# EAGLE design Practicum_update (EAGLE 9.5.1)
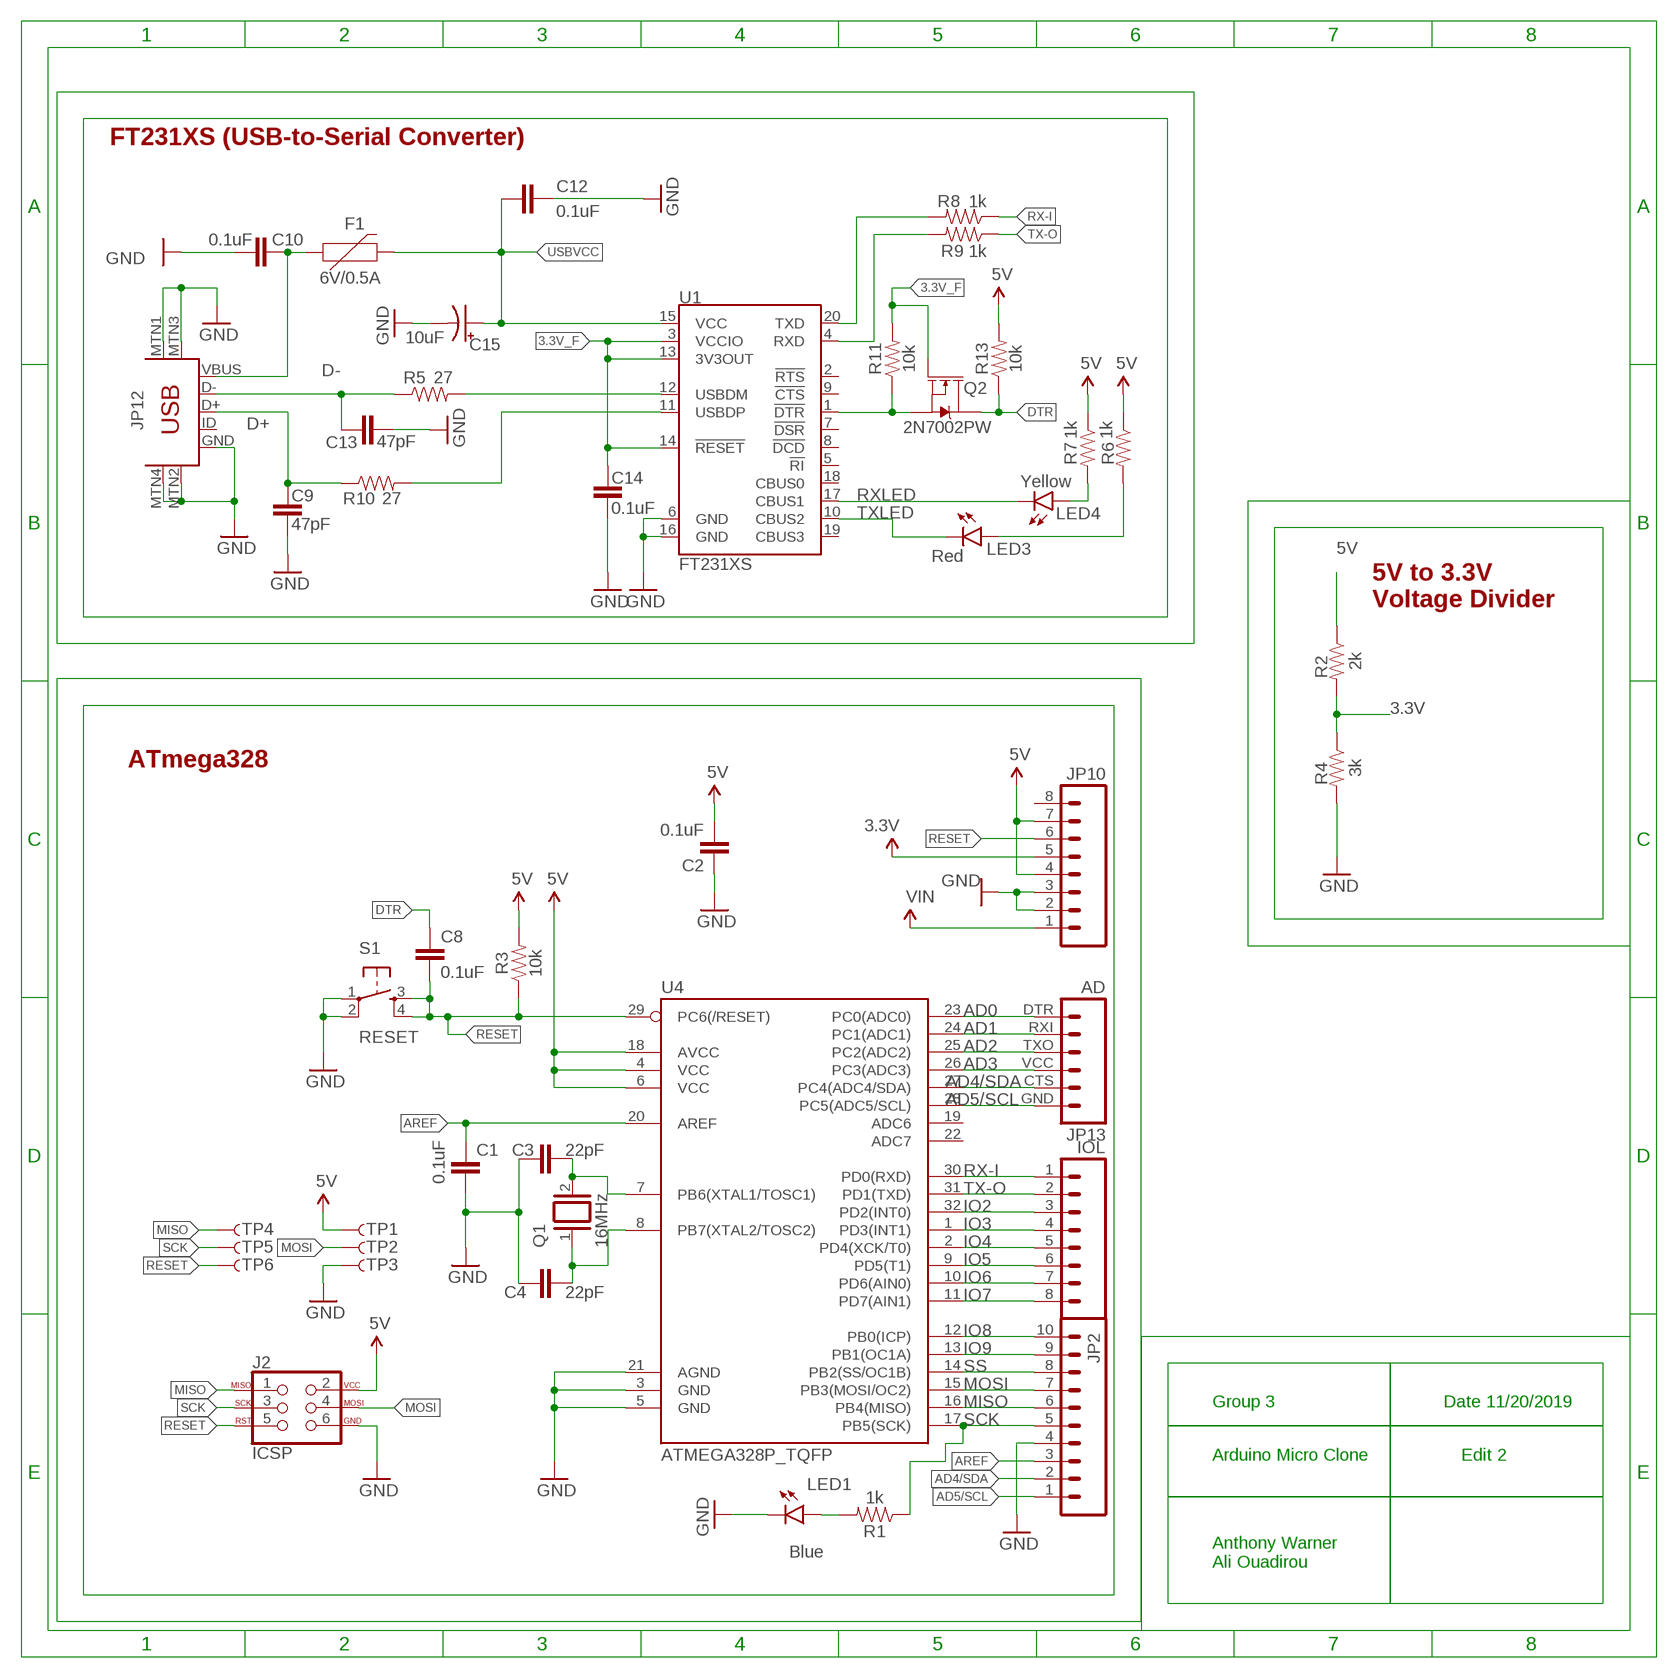
[diagram p0: schematic, sheet 1]

## Parts
C1  0.1uF  0.1UF-0603-25V-(+80/-20%)  [0603]
C2  0.1uF  0.1UF-0603-25V-(+80/-20%)  [0603]
C3  22pF  0.1UF-0603-25V-(+80/-20%)  [0603]
C4  22pF  0.1UF-0603-25V-(+80/-20%)  [0603]
C8  0.1uF  0.1UF-0603-25V-(+80/-20%)  [0603]
C9  47pF  47PF-0603-50V-5%  [0603]
C10  0.1uF  0.1UF-0603-25V-(+80/-20%)  [0603]
C12  0.1uF  0.1UF-0603-25V-(+80/-20%)  [0603]
C13  47pF  47PF-0603-50V-5%  [0603]
C14  0.1uF  0.1UF-0603-25V-(+80/-20%)  [0603]
C15  10uF  10UF-POLAR-EIA3216-16V-10%(TANT)  [EIA3216]
F1  6V/0.5A  PTC-HALF_AMP  [1206]
J2  ICSP  AVR_SPI_PROG_3X2NS  [2X3-NS]
JP2  M10"  [1X10]
JP10  M081X08  [1X08]
JP11  IOL  M081X08  [1X08]
JP12  USB-MINIB-5PIN  [USB-MINIB]
JP13  AD  M06SIP  [1X06]
LED1  Blue  LED1206  [LED-1206]
LED3  Red  LED1206  [LED-1206]
LED4  Yellow  LED1206  [LED-1206]
Q1  16MHz  XTAL/S  [QS]
Q2  2N7002PW  MOSFET-NCH-2N7002PW  [SOT323]
R1  1k  1KOHM-0603-1/10W-1%  [0603]
R2  2k  1KOHM-0603-1/10W-1%  [0603]
R3  10k  10KOHM-0603-1/10W-1%  [0603]
R4  3k  1KOHM-0603-1/10W-1%  [0603]
R5  27  27OHM-0603-1/10W-1%  [0603]
R6  1k  1KOHM-0603-1/10W-1%  [0603]
R7  1k  1KOHM-0603-1/10W-1%  [0603]
R8  1k  1KOHM-0603-1/10W-1%  [0603]
R9  1k  1KOHM-0603-1/10W-1%  [0603]
R10  27  27OHM-0603-1/10W-1%  [0603]
R11  10k  10KOHM-0603-1/10W-1%  [0603]
R13  10k  10KOHM-0603-1/10W-1%  [0603]
S1  RESET  SWITCH_SPST_4_PINSQUARE  [TACTILE-SWITCH-SMD]
TP1  TP-3x5  TEST-POINT3X5  [PAD.03X.05]
TP2  TP-3x5  TEST-POINT3X5  [PAD.03X.05]
TP3  TP-3x5  TEST-POINT3X5  [PAD.03X.05]
TP4  TP-3x5  TEST-POINT3X5  [PAD.03X.05]
TP5  TP-3x5  TEST-POINT3X5  [PAD.03X.05]
TP6  TP-3x5  TEST-POINT3X5  [PAD.03X.05]
U1  FT231XS  [SSOP20_L]
U4  ATMEGA328P_TQFP  [TQFP32-08]

## Nets
3.3V [3.3V]: JP10.5 R2.2 R4.1
3.3V_F [3.3V]: C14.1 Q2.1(G) R11.2 U1.3(VCCIO) U1.13(3V3OUT) U1.14(!RESET)
5V [5V]: C2.2 J2.2 JP10.4 JP10.7 R2.1 R3.2 R6.1 R7.1 R13.2 TP1.P$1 U4.4(VCC) U4.6(VCC) U4.18(AVCC)
AD0: JP13.DTR U4.23(PC0(ADC0))
AD1: JP13.RXI U4.24(PC1(ADC1))
AD2: JP13.TXO U4.25(PC2(ADC2))
AD3: JP13.VCC U4.26(PC3(ADC3))
AD4/SDA: JP2.2 JP13.CTS U4.27(PC4(ADC4/SDA))
AD5/SCL: JP2.1 JP13.GND U4.28(PC5(ADC5/SCL))
AREF: C1.1 JP2.3 U4.20(AREF)
D+: C9.1 JP12.D+ R10.1
D-: C13.1 JP12.D- R5.1
DTR: C8.1 Q2.3(D) R13.1
FTDI_DTR: Q2.2(S) R11.1 U1.1(!DTR)
GND [GND]: C1.2 C2.1 C3.1 C4.1 C9.2 C10.2 C12.2 C13.2 C14.2 C15.- J2.6 JP2.4 JP10.2 JP10.3 JP12.GND JP12.MTN1(MTN2) JP12.MTN2(MTN3) JP12.MTN3(MTN1) JP12.MTN4 LED1.C R4.2 S1.1 S1.2 TP3.P$1 U1.6(GND) U1.16(GND) U4.3(GND) U4.5(GND) U4.21(AGND)
IO2: JP11.3 U4.32(PD2(INT0))
IO3: JP11.4 U4.1(PD3(INT1))
IO4: JP11.5 U4.2(PD4(XCK/T0))
IO5: JP11.6 U4.9(PD5(T1))
IO6: JP11.7 U4.10(PD6(AIN0))
IO7: JP11.8 U4.11(PD7(AIN1))
IO8: JP2.10 U4.12(PB0(ICP))
IO9: JP2.9 U4.13(PB1(OC1A))
MISO: J2.1 JP2.6 TP4.P$1 U4.16(PB4(MISO))
MOSI: J2.4 JP2.7 TP2.P$1 U4.15(PB3(MOSI/OC2))
N$1: LED1.A R1.2
N$2: C4.2 Q1.1 U4.8(PB7(XTAL2/TOSC2))
N$3: C3.2 Q1.2 U4.7(PB6(XTAL1/TOSC1))
N$5: R10.2 U1.11(USBDP)
N$6: R5.2 U1.12(USBDM)
N$8: LED3.A R6.2
N$10: LED4.A R7.2
RESET: C8.2 J2.5 JP10.6 R3.1 S1.3 S1.4 TP6.P$1 U4.29(PC6(/RESET))
RX-I: JP11.1 R8.1 U4.30(PD0(RXD))
RXD: R9.2 U1.4(RXD)
RXLED: LED4.C U1.17(CBUS1)
SCK: J2.3 JP2.5 R1.1 TP5.P$1 U4.17(PB5(SCK))
SS: JP2.8 U4.14(PB2(SS/OC1B))
TX-O: JP11.2 R9.1 U4.31(PD1(TXD))
TXD: R8.2 U1.20(TXD)
TXLED: LED3.C U1.10(CBUS2)
USBVCC: C12.1 C15.+ F1.2 U1.15(VCC)
VIN: JP10.1
VUSB: C10.1 F1.1 JP12.VBUS
Unconnected: JP10.8 JP12.ID U1.2(!RTS) U1.5(!RI) U1.7(!DSR) U1.8(!DCD) U1.9(!CTS) U1.18(CBUS0) U1.19(CBUS3) U4.19(ADC6) U4.22(ADC7)

## Notes on the sheet
- FT231XS (USB-to-Serial Converter)
- 5V to 3.3V
  Voltage Divider
- ATmega328
- Group 3 | Date 11/20/2019
- Arduino Micro Clone | Edit 2
- Anthony Warner
  Ali Ouadirou

## Library data of the parts
C1 C2 C8 C10 C12 C14 = SparkFun-Capacitors:0.1UF: 0.1µF ceramic capacitors A capacitor is a passive two-terminal electrical component used to store electrical energy temporarily in an electric field.; PROD_ID: CAP-00810
C3 C4 = SparkFun-Capacitors:0.1UF: 0.1µF ceramic capacitors A capacitor is a passive two-terminal electrical component used to store electrical energy temporarily in an electric field.; PROD_ID: CAP-00810; VALUE: 0.1uF
C9 C13 = SparkFun-Capacitors:47PF: 47pF ceramic capacitors A capacitor is a passive two-terminal electrical component used to store electrical energy temporarily in an electric field.; PROD_ID: CAP-08913
C15 = SparkFun-Capacitors:10UF-POLAR: 10.0µF polarized capacitors A capacitor is a passive two-terminal electrical component used to store electrical energy temporarily in an electric field.; PROD_ID: CAP-00811
F1 = SparkFun-Fuses:PTC: Resettable Fuse PTC Resettable Fuse. Really a resistor with a postive temperature coefficient who's resistance increases dramatically with an increase in temperature. When heated by the power passing through the resistance rises causing the current to be limited, protecting the circuit. When a PTC cools back down it resumes conducting letting the circuit turn back on.; PROD_ID: RES-08585
J2 = SparkFun-Connectors:AVR_SPI_PROG_3X2: AVR ISP 6 Pin This is the reduced ISP connector for AVR programming. Common on Arduino. This footprint will take up less PCB space and can be used with a 10-pin to 6-pin adapter such as SKU: BOB-08508 **Special note about "TEST_POINT" package. The stop mask is on the top side, so if you want your programming test points to be on the bottom of your board, make sure to place this package on the bottom side of the board. This also ensure that the orientation to program from the bottom side will be correct.
JP2 = SparkFun-Connectors:M10: Header 10 Standard 10-pin 0.1" header. Use with straight break away headers (SKU : PRT-00116), right angle break away headers (PRT-00553), swiss pins (PRT-00743), machine pins (PRT-00117), and female headers (PRT-00115).; PROD_ID: CONN-11219
JP10 JP11 = SparkFun-Connectors:M08: Header 8 Standard 8-pin 0.1" header. Use with straight break away headers (SKU : PRT-00116), right angle break away headers (PRT-00553), swiss pins (PRT-00743), machine pins (PRT-00117), and female headers (PRT-00115).; PROD_ID: CONN-10204
JP12 = SparkFun-Connectors:USB-MINIB: Mini-USB "B" connector with 5th pin broken out. Created new symbol breaking out 5th "ID" pin in mini/micro USB connector spec. See: http://en.wikipedia.org/wiki/Mini_usb#Cables. Uses same footprint as 4-pin symbol. Also added pins to connect to mounting / shield pads if required (probably not generally needed as signals aren't shielded once they leave the connector).; PROD_ID: CONN-08193
JP13 = SparkFun-Connectors:M06: Header 6 Standard 6-pin 0.1" header. Use with straight break away headers (SKU : PRT-00116), right angle break away headers (PRT-00553), swiss pins (PRT-00743), machine pins (PRT-00117), and female headers (PRT-00115). Molex polarized connector foot print use with SKU : PRT-08094 with associated crimp pins and housings. NOTES ON THE VARIANTS LOCK and LOCK_LONGPADS... This footprint was designed to help hold the alignment of a through-hole component (i.e. 6-pin header) while soldering it into place. You may notice that each hole has been shifted either up or down by 0.005 of an inch from it's more standard position (which is a perfectly straight line). This slight alteration caused the pins (the squares in the middle) to touch the edges of the holes. Because they are alternating, it causes a "brace" to hold the component in place. 0.005 has proven to be the perfect amount of "off-center" position when using our standard breakaway headers. Although looks a little odd when you look at the bare footprint, once you have a header in there, the alteration is very hard to notice. Also,if you push a header all the way into place, it is covered up entirely on the bottom side. This idea of altering the position of holes to aid alignment will be further integrated into the Sparkfun Library for other footprints. It can help hold any component with 3 or more connection pins.; PROD_ID: CONN-10203
LED1 = SparkFun-LED:LED: LED (Generic) Standard schematic elements and footprints for 5mm, 3mm, 1206, and 0603 sized LEDs. Generic LEDs with no color specified.; PROD_ID: DIO-09911
LED3 = SparkFun-LED:LED: LED (Generic) Standard schematic elements and footprints for 5mm, 3mm, 1206, and 0603 sized LEDs. Generic LEDs with no color specified.; PROD_ID: DIO-09912
LED4 = SparkFun-LED:LED: LED (Generic) Standard schematic elements and footprints for 5mm, 3mm, 1206, and 0603 sized LEDs. Generic LEDs with no color specified.; PROD_ID: DIO-09909
Q1 = special:XTAL/S: CRYSTAL
Q2 = SparkFun-DiscreteSemi:MOSFET-NCH: N-channel MOSFETs Voltage controlled devices that allow control of high current outputs.; PROD_ID: TRANS-11151; VALUE: 310mA/60V/1.6Ω
R1 R6-R9 = SparkFun-Resistors:1KOHM: 1kΩ resistor A resistor is a passive two-terminal electrical component that implements electrical resistance as a circuit element. Resistors act to reduce current flow, and, at the same time, act to lower voltage levels within circuits.; PROD_ID: RES-07856
R2 R4 = SparkFun-Resistors:1KOHM: 1kΩ resistor A resistor is a passive two-terminal electrical component that implements electrical resistance as a circuit element. Resistors act to reduce current flow, and, at the same time, act to lower voltage levels within circuits.; PROD_ID: RES-07856; VALUE: 1k
R3 R11 R13 = SparkFun-Resistors:10KOHM: 10kΩ resistor A resistor is a passive two-terminal electrical component that implements electrical resistance as a circuit element. Resistors act to reduce current flow, and, at the same time, act to lower voltage levels within circuits.; PROD_ID: RES-00824
R5 R10 = SparkFun-Resistors:27OHM: 27Ω resistor A resistor is a passive two-terminal electrical component that implements electrical resistance as a circuit element. Resistors act to reduce current flow, and, at the same time, act to lower voltage levels within circuits.; PROD_ID: RES-09334
S1 = SparkFun-Electromechanical:SWITCH_SPST_4_PIN; PROD_ID: SWCH-08247
TP1-TP4 TP6 = SparkFun-Connectors:TEST-POINT: Bare copper test points for troubleshooting or ICT
TP5 = SparkFun-Passives:TEST-POINT: Bare copper test points for troubleshooting or ICT
U1 = SparkFun-IC-Comms:FT231X: FTDI FT231X Full Speed USB to Full-handshake UART This USB2.0 Full Speed IC offers a compact bridge to full handshake UART interfaces. The device is a UART, capable of operating up to 3MBaud, with low power consumption (8mA). The FT231X includes the complete FT-X series feature set and enables USB to be added into a system design quickly and easily over a UART interface.; PROD_ID: IC-11524
U4 = SparkFun-IC-Microcontroller:ATMEGA328P_TQFP; PROD_ID: IC-09069

## Net classes
0 default: width 0.356 mm, drill 0.305 mm, clearance 0.152 mm
1 5V: width 0.61 mm, drill 0.305 mm, clearance 0.152 mm to class 0, clearance 0.152 mm
2 3.3V: width 0.61 mm, drill 0.305 mm, clearance 0.152 mm to class 0, clearance 0.152 mm
3 GND: width 0.356 mm, drill 0.305 mm, clearance 0.152 mm to class 0, clearance 0.152 mm

## Board
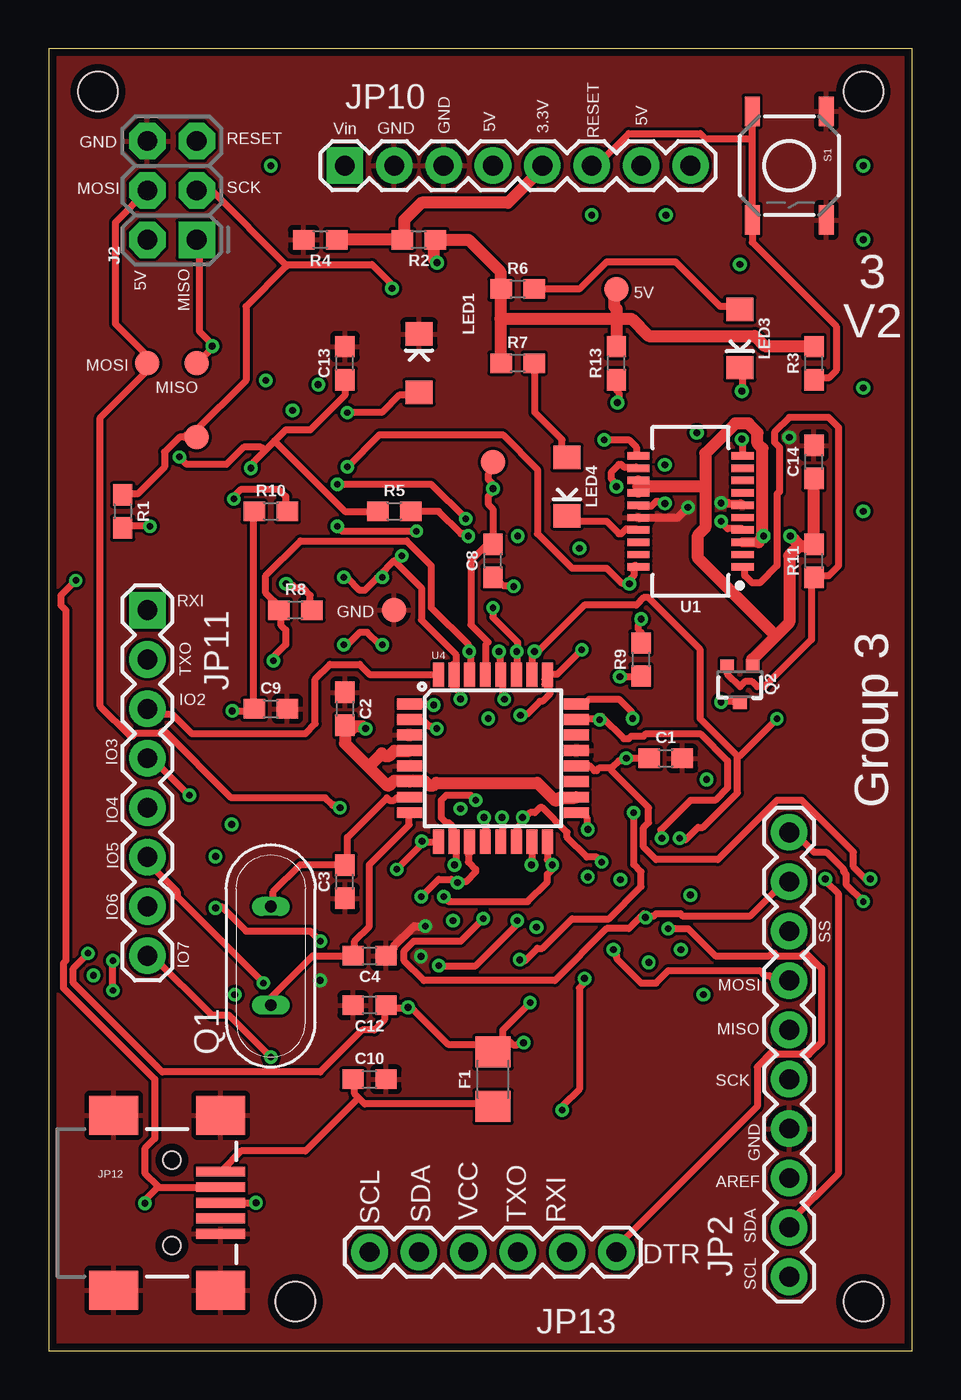
[diagram p1: board, top side]
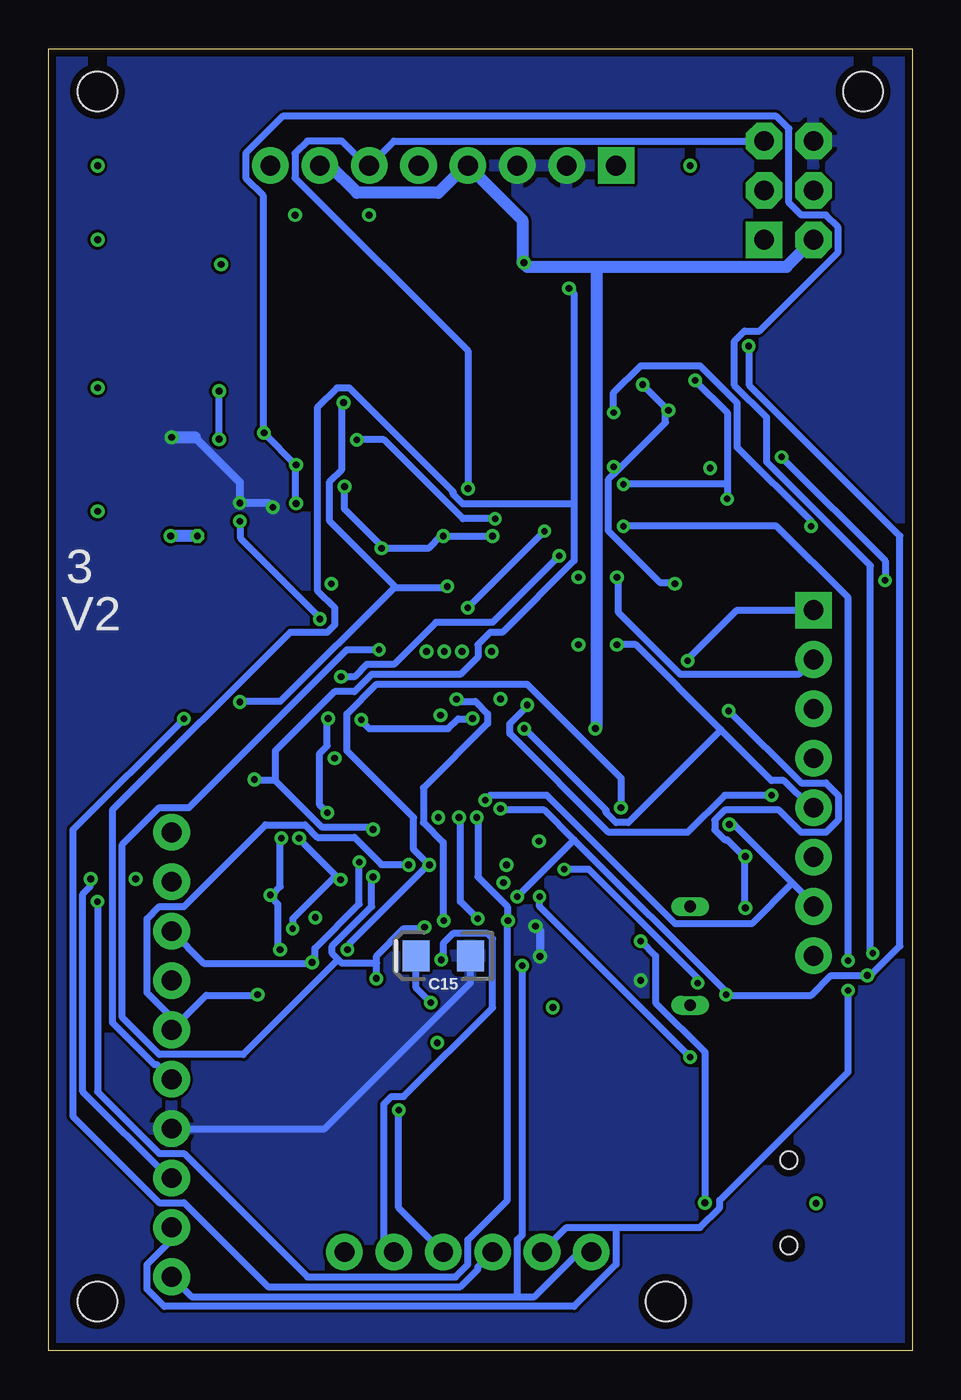
[diagram p2: board, bottom side, seen from below]

Size 44.43 x 66.98 mm. Coordinates in mm from the lower left corner, seen from the top.
Outline: 0,0 44.43,0 44.43,66.98 0,66.98 0,0
Copper layers (1*16): Top 0.0356mm / dielectric 1.5011mm / Bottom 0.0356mm
Design rules "LaenPCBOrder": minimum track width 6mil, minimum drill 13mil, track to track 6mil, track to pad 6mil, pad to pad 6mil, via to via 6mil, smd to smd 6mil, copper to edge 15mil, drill to drill 6mil, minimum pad ring 7mil, minimum via ring 7mil, stop-mask expansion 3mil, vias tented up to drill 0mil, thermal gap 10mil
Holes 2.03 mm at 2.54,64.77 41.91,64.77 12.7,2.54 41.91,2.54

### Footprints (pad centres in the part's own frame; a part is rotated, then mirrored left to right if it is on the bottom)
0603 = smd 1.1 x 1: 1 -0.85,0; 2 0.85,0
EIA3216 = smd 1.4 x 1.6: + 1.4,0; - -1.4,0
1206 = smd 1.6 x 1.8: 1 -1.4,0; 2 1.4,0
2X3-NS = drill 1.016 pad 1.88 square: 1 -2.54,-1.27 | drill 1.016 pad 1.88 octagon: 2 -2.54,1.27; 3 0,-1.27; 4 0,1.27; 5 2.54,-1.27; 6 2.54,1.27
1X10 = drill 1.016 pad 1.88: 1 0,0; 2 2.54,0; 3 5.08,0; 4 7.62,0; 5 10.16,0; 6 12.7,0; 7 15.24,0; 8 17.78,0; 9 20.32,0; 10 22.86,0
1X08 = drill 1.016 pad 1.88 square: 1 0,0 | drill 1.016 pad 1.88: 2 2.54,0; 3 5.08,0; 4 7.62,0; 5 10.16,0; 6 12.7,0; 7 15.24,0; 8 17.78,0
USB-MINIB = smd 2.5 x 0.5: D+ 2.5,0; D- 2.5,0.8; GND 2.5,-1.6; ID 2.5,-0.8; VBUS 2.5,1.6 | smd 2.5 x 2: MTN1 -3,4.5; MTN2 2.5,4.5; MTN3 -3,-4.5; MTN4 2.5,-4.5 | hole 0.9: 0,2.2; 0,-2.2
1X06 = drill 1.016 pad 1.88: CTS 10.16,0; DTR 0,0; GND 12.7,0; RXI 2.54,0; TXO 5.08,0; VCC 7.62,0
LED-1206 = smd 1.2 x 1.4: A -1.5,0; C 1.5,0
QS = drill 0.61 long: 1 -2.54,0; 2 2.54,0
SOT323 = smd 0.7 x 0.7: 1 -0.65,-0.925; 2 0.65,-0.925; 3 0,0.925
TACTILE-SWITCH-SMD = smd 1.524 x 0.762: 1 -2.794,1.905; 2 2.794,1.905; 3 -2.794,-1.905; 4 2.794,-1.905
PAD.03X.05 = smd 1.27 x 1.27: P$1 0,0
SSOP20_L = smd 0.381 x 1.143: 1 -2.857,-2.68; 2 -2.223,-2.68; 3 -1.587,-2.68; 4 -0.953,-2.68; 5 -0.318,-2.68; 6 0.318,-2.68; 7 0.953,-2.68; 8 1.587,-2.68; 9 2.223,-2.68; 10 2.857,-2.68; 11 2.857,2.68; 12 2.223,2.68; 13 1.587,2.68; 14 0.953,2.68; 15 0.318,2.68; 16 -0.318,2.68; 17 -0.953,2.68; 18 -1.587,2.68; 19 -2.223,2.68; 20 -2.857,2.68
TQFP32-08 = smd 1.27 x 0.559: 1 -4.293,2.8; 2 -4.293,2; 3 -4.293,1.2; 4 -4.293,0.4; 5 -4.293,-0.4; 6 -4.293,-1.2; 7 -4.293,-2; 8 -4.293,-2.8; 17 4.293,-2.8; 18 4.293,-2; 19 4.293,-1.2; 20 4.293,-0.4; 21 4.293,0.4; 22 4.293,1.2; 23 4.293,2; 24 4.293,2.8 | smd 0.559 x 1.27: 9 -2.8,-4.293; 10 -2,-4.293; 11 -1.2,-4.293; 12 -0.4,-4.293; 13 0.4,-4.293; 14 1.2,-4.293; 15 2,-4.293; 16 2.8,-4.293; 25 2.8,4.293; 26 2,4.293; 27 1.2,4.293; 28 0.4,4.293; 29 -0.4,4.293; 30 -1.2,4.293; 31 -2,4.293; 32 -2.8,4.293

### Placement (x,y rotation side)
C1  31.75,30.48 0 top
C2  15.24,33.02 270 top
C3  15.24,24.13 90 top
C4  16.51,20.32 180 top
C8  22.86,40.64 90 top
C9  11.43,33.02 0 top
C10  16.51,13.97 0 top
C12  16.51,17.78 180 top
C13  15.24,50.8 90 top
C14  39.37,45.72 90 top
C15  24.13,20.32 180 bottom
F1  22.86,13.97 90 top
J2  6.35,59.69 90 top
JP2  38.1,3.81 90 top
JP10  15.24,60.96 0 top
JP11  5.08,38.1 270 top
JP12  6.35,7.62 0 top
JP13  29.21,5.08 180 top
LED1  19.05,50.8 90 top
LED3  35.56,52.07 270 top
LED4  26.67,44.45 270 top
Q1  11.43,20.32 90 top
Q2  35.56,34.29 180 top
R1  3.81,43.18 270 top
R2  19.05,57.15 180 top
R3  39.37,50.8 90 top
R4  13.97,57.15 180 top
R5  17.78,43.18 0 top
R6  24.13,54.61 0 top
R7  24.13,50.8 0 top
R8  12.7,38.1 0 top
R9  30.48,35.56 90 top
R10  11.43,43.18 0 top
R11  39.37,40.64 90 top
R13  29.21,50.8 90 top
S1  38.1,60.96 270 top
TP1  29.21,54.61 0 top
TP2  5.08,50.8 0 top
TP3  17.78,38.1 0 top
TP4  7.62,50.8 0 top
TP5  7.62,46.99 0 top
TP6  22.86,45.72 0 top
U1  33.02,43.18 90 top
U4  22.86,30.48 0 top

### Tracks (layer width: path | path; a pad name or v marks a point on that pad's centre or on a via)
3.3V
  Top 0.61: R4.1 R2.2 18.29,57.4 18.29,58.17 19.18,59.05 23.62,59.05 25.4,60.83 JP10.5
3.3V_F  (via drill 0.35, 0.35 pad 0.55)
  Top 0.508: U1.3 36.51,41.59 | U1.13 30.34,44.48 U1.14
  Top 0.61: 37.4,36.77 38.1,37.47 38.1,40.89 38.61,41.4 38.66,41.4 | 37.4,36.77 36.2,35.56 36.2,35.31 Q2.1 | C14.1 R11.2 39.37,41.4 38.66,41.4 | 37.4,36.77 33.4,40.77 33.4,41.95 33.78,42.34 33.78,44.55 | 36.51,41.59 v36.78,41.91 36.73,41.96 36.73,46.42 36.47,46.67 36.47,47.22 36,47.7 35.33,47.7 33.78,46.16 33.78,44.55 | v38.15,41.91 38.66,41.4 | 30.34,44.48 33.71,44.48 33.78,44.55
  Bottom 0.61: v36.78,41.91 v38.15,41.91
5V  (via drill 0.35)
  Top 0.61: v16.31,32 16.26,32 16.13,32.13 15.75,32.13 15.62,32 15.37,32 15.24,32.13 C2.2 15.24,31.24 16.45,30.04 | 16.45,30.04 17.4,29.08 17.53,29.08 17.78,29.34 18.54,29.34 U4.6 18.8,29.34 19.3,29.34 19.56,29.08 19.81,29.08 19.94,29.21 25.15,29.21 26.04,28.32 26.16,28.32 26.29,28.45 27.05,28.45 U4.18 | 16.45,30.04 17.14,30.73 17.27,30.61 17.53,30.61 17.78,30.86 18.54,30.86 U4.4 | 29.21,53.09 29.21,53.59 29.08,53.72 29.08,54.48 TP1.P$1 | 29.21,53.09 R13.2 | 29.21,53.09 29.97,53.09 30.86,52.2 36.32,52.2 36.83,51.69 39.37,51.69 R3.2 | 23.24,53.09 23.24,54.61 R6.1 23.24,54.86 23.24,55.5 21.59,57.15 R2.1 19.94,57.15 19.94,56.9 19.81,56.77 19.81,56.13 v19.98,55.97 | 23.24,53.09 23.24,50.8 R7.1 | 23.24,53.09 29.21,53.09
  Bottom 0.61: J2.2 6.48,55.75 16.26,55.75 | 16.26,55.75 19.81,55.75 v19.98,55.97 20.07,56.01 20.07,58.17 JP10.4 23.11,60.83 24.38,59.56 28.57,59.56 29.97,60.96 JP10.7 | 16.26,55.75 16.26,32 v16.31,32
AD0  (via drill 0.33, 0.35)
  Top 0.356: U4.23 27.18,32.51 28.32,32.51 v28.35,32.46 28.45,32.64 29.59,31.5 29.84,31.5 29.97,31.62 30.61,31.62 30.73,31.75 33.53,31.75 34.92,30.35 34.92,28.96 34.29,28.32 33.02,28.32 31.5,26.8 31.5,26.42 v31.55,26.36 | JP13.DTR 29.21,5.33 36.45,12.57 36.45,14.61 37.21,15.37 37.34,15.37 37.47,15.24 38.73,15.24 38.86,15.37 38.99,15.37 39.12,15.24 39.75,15.88 39.75,19.68 38.99,20.45 38.86,20.45 38.73,20.32 37.47,20.32 37.34,20.45 37.21,20.45 37.08,20.32 34.29,20.32 32.89,21.72 v31.88,21.72
  Bottom 0.356: v31.55,26.36 31.5,26.29 29.46,24.26 v29.41,24.23 29.72,24.38 31.88,22.23 v31.88,21.72 | v22.62,32.52 22.73,32.51 23.37,32.51 23.88,32 27.94,32 28.32,32.38 v28.35,32.46
AD1  (via drill 0.33, 0.35)
  Top 0.356: v30.05,32.52 29.97,32.64 29.97,32.89 29.34,33.53 27.81,33.53 27.56,33.27 27.18,33.27 U4.24 | v30.1,27.69 30.1,25.02 30.48,24.64 30.48,23.88 28.83,22.23 26.92,22.23 25.4,20.7 25.15,20.7 24.51,20.07 24.26,20.07 v24.23,20.12
  Bottom 0.356: JP13.RXI 27.18,5.59 27.18,12.7 26.8,13.08 26.16,13.08 21.59,17.65 21.59,21.21 21.84,21.46 23.62,21.46 24.13,20.95 24.13,20.19 v24.23,20.12 | v30.1,27.69 30.48,28.07 30.48,30.73 30.1,31.11 30.1,32.51 v30.05,32.52
AD2  (via drill 0.33, 0.35)
  Top 0.356: v24.27,32.69 24.38,32.77 24.64,32.77 25.27,33.4 25.4,33.4 25.78,33.78 25.78,34.04 25.53,34.29 25.53,34.54 25.65,34.67 U4.25 25.78,34.8 26.16,34.8 v27.43,36.07 | v26.42,12.38 26.42,12.57 27.3,13.46 27.3,18.67 27.69,19.05 v27.57,19.15
  Bottom 0.356: v26.42,12.38 26.42,7.37 JP13.TXO | 27.56,19.94 27.56,19.18 v27.57,19.15 | 27.56,19.94 27.56,20.32 26.16,21.72 25.15,21.72 v25.09,21.79 | 29.53,20.13 29.34,19.94 27.56,19.94 | 29.53,20.13 29.84,20.45 29.84,20.83 27.81,22.86 27.81,24.38 v27.74,24.38 | v27.43,36.07 29.08,36.07 37.21,27.94 38.73,27.94 40.64,26.04 40.64,17.14 38.73,15.24 34.42,15.24 29.53,20.13
AD3  (via drill 0.33, 0.35)
  Top 0.356: U4.26 24.89,34.8 24.89,35.94 v24.99,35.97 25.15,36.07 25.27,36.07 27.56,38.35 30.23,38.35 30.61,38.73 30.86,38.73 33.53,36.07 33.53,32.51 35.43,30.61 | 35.43,30.61 35.43,28.7 33.66,26.92 33.4,26.92 32.77,26.29 32.64,26.42 32.51,26.42 v32.46,26.36 | v37.47,32.51 35.56,30.61 35.43,30.61
  Bottom 0.356: v32.52,20.64 32.64,20.7 32.64,22.99 33.02,23.37 v33.02,23.44 32.89,23.5 32.51,23.88 32.51,26.29 v32.46,26.36 | JP13.VCC 22.35,4.32 22.35,4.19 23.24,3.3 33.15,3.3 37.47,7.62 38.73,7.62 43.18,12.06 43.18,26.8 v37.47,32.51
AD4/SDA  (via drill 0.33, 0.35)
  Top 0.356: JP2.2 38.1,6.6 40.64,9.14 40.64,23.5 40.01,24.13 40.01,24.26 v39.95,24.27 | U4.27 24.13,34.8 24.13,35.94 v24.08,35.97 24.13,36.07 24.13,36.45 22.86,37.72 v22.86,38.23 | v18.92,42.16 18.8,42.04 18.67,42.16 15.11,42.16 v14.86,42.42 | v3.3,18.54 v3.3,20.07
  Bottom 0.356: v18.92,42.16 v22.86,38.23 | v14.86,42.42 6.99,42.42 3.3,38.73 v3.3,20.07 | v3.3,18.54 3.3,14.35 9.91,7.75 9.91,7.37 10.92,6.35 15.24,6.35 | 15.24,6.35 17.78,6.35 JP13.CTS | JP2.2 38.1,5.71 39.37,4.45 39.37,3.17 38.48,2.29 17.4,2.29 15.24,4.45 15.24,6.35
AD5/SCL  (via drill 0.33, 0.35)
  Top 0.356: v23.16,35.97 23.24,35.94 23.24,34.8 U4.28 23.37,34.67 23.37,33.53 v23.44,33.52 | v20.07,19.81 21.97,19.81 24,21.84 24,22.1 v24.11,22.12
  Bottom 0.356: v24.11,22.12 24.13,22.23 24.13,26.16 25.15,27.18 25.15,28.96 21.84,32.26 21.84,32.77 22.48,33.4 23.37,33.4 v23.44,33.52 | JP13.GND 17.14,5.08 19.43,2.79 20.32,2.79 | 20.32,2.79 37.08,2.79 JP2.1 | v20.07,19.81 20.07,5.97 20.32,5.71 20.32,2.79
AREF  (via drill 0.35)
  Top 0.356: C1.1 v29.72,30.48 29.72,30.35 29.34,30.35 28.96,29.97 | 28.96,29.97 28.32,29.97 28.19,29.84 28.07,29.84 27.81,30.1 27.18,30.1 U4.20 | 28.96,29.97 28.96,29.84 30.86,27.94 30.86,27.18 30.61,26.92 30.61,25.91 31.24,25.27 34.42,25.27 37.47,28.32 38.73,28.32 41.4,25.65 41.4,24.89 42.16,24.13 42.29,24.26 v42.27,24.27
  Bottom 0.356: JP2.3 38.23,8.89 42.67,13.34 42.67,23.5 42.29,23.88 42.29,24.26 v42.27,24.27
D+  (via drill 0.33, 0.35)
  Top 0.356: JP12.D+ v10.67,7.62 | v9.45,32.92 9.53,32.89 10.41,32.89 10.54,33.02 C9.1 10.54,33.15 10.54,43.18 R10.1 | v13.97,21.08 13.46,21.59 10.16,21.59 8.89,22.86 8.76,22.73 8.64,22.73 v8.59,22.78
  Bottom 0.356: v8.59,22.78 8.64,22.86 8.64,25.4 v8.59,25.43 8.76,25.53 9.53,26.29 9.65,26.29 10.16,26.8 10.16,27.3 9.65,27.81 6.86,27.81 5.71,26.67 4.45,26.67 3.81,27.3 3.81,28.57 4.45,29.21 5.71,29.21 9.4,32.89 v9.45,32.92 | v10.67,7.62 10.67,15.37 13.21,17.91 13.21,20.32 v13.97,21.08
D-  (via drill 0.33, 0.35)
  Top 0.356: v4.95,7.59 4.95,7.75 5.59,8.38 | 5.59,8.38 8.76,8.38 JP12.D- | 11.62,46.8 12.19,47.37 13.46,47.37 15.24,49.15 C13.1 | 11.62,46.8 11.11,46.29 | 11.11,46.29 10.41,45.59 10.41,45.47 v10.4,45.4 | R5.1 15.24,43.18 11.62,46.8 | v1.4,39.62 0.64,38.86 0.64,38.35 0.89,38.1 0.89,20.07 0.76,19.94 0.76,18.67 5.46,13.97 5.46,10.92 4.95,10.41 4.95,9.14 5.59,8.51 5.59,8.38 | v6.73,45.97 7.11,45.59 9.14,45.59 10.03,46.48 10.92,46.48 11.11,46.29
  Bottom 0.356: v1.4,39.62 1.4,40.64 v6.73,45.97
DTR  (via drill 0.35)
  Top 0.356: R13.1 29.21,49.4 29.34,49.28 29.34,48.77 v29.26,48.77 | v34.59,33.38 34.67,33.4 35.56,33.4 Q2.3 | v23.93,39.32 23.88,39.37 23.37,39.37 22.86,39.88 C8.1
  Bottom 0.356: 26.67,39.24 32.51,33.4 34.54,33.4 v34.59,33.38 | 26.67,39.24 24,39.24 v23.93,39.32 | v29.26,48.77 29.34,48.77 29.34,45.34 29.97,44.7 29.97,42.67 26.67,39.37 26.67,39.24
FTDI_DTR
  Top 0.356: Q2.2 34.92,35.18 34.92,34.8 35.56,34.16 35.81,34.42 36.2,34.42 36.45,34.16 36.83,34.16 39.24,36.58 39.24,39.62 39.37,39.75 R11.1 39.5,39.88 40.13,39.88 40.64,40.39 40.64,47.5 40.13,48.01 38.1,48.01 37.34,47.24 37.34,46.74 37.59,46.48 37.59,44.2 37.47,44.07 37.47,40.39 36.58,39.5 36.2,39.5 35.81,39.88 35.81,40.26 U1.1
GND  (via drill 0.35)
  Top 0.406: U1.16 32.37,42.86 v32.89,43.38 | v34.59,43.61 34.96,43.61 34.98,43.59 35.61,43.59 U1.6 | C4.1 17.75,20.71 17.75,20.8 18.8,21.84 v19.38,21.84
  Bottom 0.356: JP2.4 30.23,11.43 22.73,18.92 C15.-
  Bottom 0.406: v32.89,43.38 33.12,43.61 v34.59,43.61 34.59,44.68 36.91,46.99 | v19.38,21.84 19.15,21.61 v19.15,20.3
  Bottom 0.61: v38.1,46.99 36.91,46.99
  other vias: 13.97,19.05
  pour Top: 0,67.31 0,0 44.45,0 44.45,67.31
  pour Bottom: 0,66.88 0,0.25 0.05,0.2 44.25,0.2 44.27,0.18 44.27,66.65 44.3,66.67 0.69,66.67
IO2
  Top 0.356: JP11.3 5.71,33.02 5.97,32.77 6.35,32.77 7.37,31.75 13.21,31.75 13.72,32.26 13.72,34.54 14.48,35.31 16,35.31 16.51,34.8 19.94,34.8 U4.32
IO3  (via drill 0.33, 0.35)
  Top 0.356: v19.81,33.22 19.81,33.27 18.67,33.27 U4.1 | v7.24,28.57 5.33,30.48 JP11.4
  Bottom 0.356: v7.24,28.57 9.65,28.57 11.56,26.67 15.62,26.67 20.7,31.75 20.7,32.26 19.81,33.15 v19.81,33.22
IO4  (via drill 0.35)
  Top 0.356: v19.96,32 19.81,32 19.68,32.13 19.56,32.13 19.3,32.38 19.18,32.38 19.05,32.51 18.67,32.51 U4.2 | v15.19,36.32 15.37,36.32 16,36.96 16.38,36.96 17.02,36.32 v17.17,36.32
  Bottom 0.356: v15.19,36.32 14.22,36.32 9.84,31.94 | 9.84,31.94 7.24,29.34 6.6,29.34 5.21,27.94 JP11.5 | 9.84,31.94 14.61,27.18 15.24,27.18 15.75,27.69 15.75,27.81 19.94,32 v19.96,32
IO5  (via drill 0.33, 0.35)
  Top 0.356: U4.9 19.94,26.16 19.3,26.16 v19.2,26.21 19.18,26.04 v17.91,24.77 | v11.05,18.92 6.6,23.37 6.6,23.62 5.08,25.15 JP11.6
  Bottom 0.356: v17.91,24.77 16.64,24.77 11.05,19.18 v11.05,18.92
IO6  (via drill 0.33, 0.35)
  Top 0.356: v20.88,24.99 20.95,25.02 20.95,26.16 U4.10 20.83,26.29 20.83,26.8 20.7,26.92 20.7,27.05 20.57,27.18 20.45,27.18 20.19,27.43 20.19,28.32 20.45,28.57 21.72,28.57 v21.97,28.32
  Bottom 0.356: 6.16,24.07 5.08,22.99 JP11.7 | 6.16,24.07 9.14,27.05 9.4,27.05 v9.41,27.08 | v21.97,28.32 21.72,28.57 18.8,28.57 12.19,21.97 8.26,21.97 6.16,24.07
IO7  (via drill 0.33, 0.35)
  Top 0.356: U4.11 21.72,26.16 21.72,25.65 21.59,25.53 21.59,25.15 21.97,24.77 21.97,24.64 21.46,24.13 21.08,24.13 v21.03,24.08 20.95,24.13 20.83,24.13 20.7,24.26 20.07,24.26 v19.18,23.37 | v11.43,15.11 9.27,17.27 8.38,17.27 5.33,20.32 JP11.8
  Bottom 0.356: v19.18,23.37 19.18,22.86 v11.43,15.11
IO8  (via drill 0.33, 0.35)
  Top 0.356: U4.12 22.48,26.29 22.48,27.43 v22.4,27.43 | v41.91,23.11 41.02,24 41.02,24.51 40.89,24.64 40.89,24.77 40.01,25.65 39.37,25.65 38.35,26.67 JP2.10
  Bottom 0.356: v22.4,27.43 22.35,27.43 22.35,24.38 20.83,22.86 20.83,22.23 v20.8,22.12 20.83,21.97 20.83,7.75 22.86,5.71 22.86,4.45 23.5,3.81 31.11,3.81 37.47,10.16 38.73,10.16 41.91,13.34 v41.91,23.11
IO9  (via drill 0.33, 0.35)
  Top 0.356: v23.32,27.43 23.37,27.43 23.37,26.29 U4.13 | JP2.9 37.85,24.13 36.07,22.35 32.64,22.35 32.51,22.48 31.24,22.48 31.11,22.35 30.73,22.35 v30.71,22.29 30.61,22.48 29.84,21.72 28.7,21.72 26.04,19.05 19.3,19.05 18.29,20.07 18.29,20.57 18.8,21.08 21.21,21.08 v22.35,22.23
  Bottom 0.356: v22.35,22.23 23.24,23.11 23.24,27.43 v23.32,27.43
MISO  (via drill 0.33, 0.35)
  Top 0.356: U4.16 25.65,26.16 25.65,25.27 25.91,25.02 v25.91,24.99 25.91,24.77 25.65,24.51 25.65,24.13 24.64,23.11 20.57,23.11 v20.32,23.37 | TP4.P$1 8.38,51.56 v8.42,51.68 8.38,51.82 7.75,52.45 7.75,57.02 J2.1
  Bottom 0.356: v33.68,18.33 33.78,18.29 36.32,18.29 JP2.6 37.85,16.89 39.37,18.41 39.37,22.23 38.73,22.86 37.47,22.86 33.27,27.05 31.24,27.05 30.61,26.42 28.7,26.42 27.3,25.02 25.91,25.02 v25.91,24.99 | 17.4,26.29 9.53,18.41 v9.58,18.33 9.53,18.29 5.21,18.29 4.19,19.3 2.41,19.3 v2.31,19.32 2.16,19.3 0.64,20.83 0.64,41.91 8.38,49.66 8.38,51.56 v8.42,51.68 | 17.4,26.29 18.92,27.81 21.08,27.81 v21.18,27.89 | 17.4,26.29 v20.32,23.37
MOSI  (via drill 0.35)
  Top 0.356: J2.4 3.43,58.04 3.43,52.83 5.08,51.18 TP2.P$1 5.08,50.42 2.67,48.01 2.67,33.15 4.19,31.62 4.32,31.62 4.45,31.75 5.71,31.75 5.84,31.88 5.97,31.88 9.4,28.45 14.22,28.45 14.61,28.07 14.73,28.07 14.86,27.94 v14.99,27.94 | U4.15 24.89,26.16 24.89,25.02 v24.84,24.99 | JP2.7 37.34,19.05 37.08,19.3 36.83,19.3 36.58,19.56 31.88,19.56 31.24,18.92 30.48,18.92 29.21,20.19 29.21,20.32 28.96,20.57 v29.06,20.64
  Bottom 0.356: v14.99,27.94 14.99,29.46 19.81,34.29 27.56,34.29 29.08,32.77 29.08,30.86 25.65,27.43 25.65,25.78 24.89,25.02 v24.84,24.99 25.02,24.89 28.96,20.95 28.96,20.7 v29.06,20.64
N$1  (via drill 0.33)
  Top 0.356: v5.21,42.42 3.81,42.42 R1.2 | v15.37,48.26 17.14,48.26 18.03,49.15 18.92,49.15 19.05,49.28 LED1.A
  Bottom 0.356: v5.21,42.42 5.21,42.67 9.02,46.48 9.02,48.77 10.92,50.67 13.97,50.67 15.37,49.28 v15.37,48.26
N$2
  Top 0.356: Q1.1 11.43,18.16 13.59,20.32 C4.2 15.75,20.45 15.75,21.08 16.51,21.84 16.51,25.02 18.54,27.05 18.54,27.56 U4.8
N$3
  Top 0.356: Q1.2 11.56,22.99 11.56,23.62 12.95,25.02 15.24,25.02 C3.2 15.37,25.02 15.37,26.42 17.4,28.45 17.53,28.32 17.78,28.32 17.91,28.45 18.54,28.45 U4.7
N$4  (via drill 0.35)
  other vias: 35.56,55.88
N$5  (via drill 0.33)
  Top 0.356: v9.53,43.81 9.53,43.94 9.91,44.32 11.81,44.32 12.19,43.94 12.19,43.18 R10.2 | v28.57,46.86 29.84,46.86 30.23,46.48 30.23,46.1 U1.11 | v21.46,42.8 19.68,44.58 v14.86,44.58
  Bottom 0.356: 9.53,44.58 9.53,48.26 v11.18,49.91 | 9.53,44.58 v9.53,43.81 | v28.57,46.86 27.18,46.86 23.11,42.8 v21.46,42.8 | 9.53,44.58 v14.86,44.58
N$6  (via drill 0.35)
  Top 0.356: R5.2 20.07,43.18 21.21,42.04 21.34,42.04 21.46,41.91 v21.59,41.91 | v29.21,44.45 29.21,44.58 28.96,44.83 28.96,45.21 29.34,45.59 29.46,45.59 29.59,45.47 30.23,45.47 U1.12
  Bottom 0.356: v21.59,41.91 v24.13,41.91 24.26,41.91 24.89,41.27 v27.3,41.27 27.3,41.4 29.21,43.31 v29.21,44.45
N$7  (via drill 0.35)
  other vias: 41.91,60.96
N$8
  Top 0.356: R6.2 27.3,54.61 28.7,56.01 32.26,56.01 34.54,53.72 35.43,53.72 35.56,53.59 LED3.A
N$9  (via drill 0.35)
  other vias: 41.91,57.15
N$10
  Top 0.356: R7.2 25.02,50.8 25.02,48.26 26.42,46.86 26.42,46.23 26.67,45.97 LED4.A
N$11  (via drill 0.35)
  other vias: 41.91,49.53
N$12  (via drill 0.35)
  other vias: 41.91,43.18
N$13  (via drill 0.35)
  other vias: 31.75,58.42
N$14  (via drill 0.35)
  other vias: 27.94,58.42
N$15  (via drill 0.35)
  other vias: 11.43,60.96
RESET  (via drill 0.35)
  Top 0.356: R3.1 39.37,50.04 40.13,50.04 40.51,50.42 40.51,52.7 36.2,57.02 S1.4 36.2,62.36 | 36.2,62.36 S1.3 | TP6.P$1 22.86,45.34 22.61,45.09 22.61,44.83 22.86,44.58 v22.86,44.35 22.73,44.32 22.73,44.07 22.61,43.94 22.61,43.56 22.86,43.31 C8.2 22.73,41.66 21.72,40.64 21.72,37.34 22.61,36.45 22.48,36.32 22.48,34.8 U4.29 | 36.2,62.36 33.78,62.36 33.53,62.61 29.84,62.61 28.19,60.96 JP10.6
  Bottom 0.356: J2.5 26.67,62.23 JP10.6 28.07,60.96 29.34,62.23 31.11,62.23 31.75,61.59 31.75,60.33 22.86,51.44 v22.86,44.35
RX-I  (via drill 0.35)
  Top 0.356: U4.30 21.72,34.8 21.72,35.94 v21.64,35.97 21.59,36.07 21.59,36.32 19.68,38.23 19.68,40.39 18.41,41.66 12.95,41.66 11.18,39.88 11.18,38.99 11.94,38.23 R8.1 11.94,38.1 11.94,37.34 12.19,37.08 12.19,36.32 11.56,35.69 v11.56,35.5
  Bottom 0.356: JP11.1 9.02,38.1 11.56,35.56 v11.56,35.5
RXD  (via drill 0.35)
  Top 0.356: v34.59,42.67 34.67,42.67 34.67,42.55 34.92,42.29 35.69,42.29 U1.4 | v30.48,37.64 30.48,37.47 30.35,37.34 30.35,37.08 30.48,36.96 R9.2
  Bottom 0.356: v34.59,42.67 34.54,42.67 34.54,41.78 30.48,37.72 v30.48,37.64
RXLED
  Top 0.356: U1.17 30.23,42.29 29.72,42.29 29.46,42.04 29.34,42.04 28.7,42.67 26.92,42.67 26.67,42.93 LED4.C
SCK  (via drill 0.35)
  Top 0.356: v27.74,26.82 27.69,26.92 27.69,27.43 27.43,27.69 27.18,27.69 U4.17 | R1.1 3.81,44.07 4.57,44.07 5.97,45.47 5.97,46.23 6.73,46.99 6.99,46.99 7.11,47.12 7.49,47.12 TP5.P$1 7.49,47.24 10.16,49.91 10.16,53.72 12.19,55.75 12.19,55.88 | 12.19,55.88 16.64,55.88 17.65,54.86 17.65,54.74 v17.67,54.65 | 12.19,55.88 8.38,59.69 J2.3
  Bottom 0.356: 32.77,29.34 33.78,29.34 v33.85,29.39 | 32.77,29.34 30.35,26.92 27.81,26.92 v27.74,26.82 | 32.77,29.34 32.77,30.86 29.72,33.91 28.7,33.91 27.81,34.8 23.24,34.8 22.35,35.69 22.35,36.32 21.72,36.96 21.08,36.96 17.4,40.64 17.4,43.56 | 17.4,43.56 17.4,54.36 17.65,54.61 v17.67,54.65 | JP2.5 38.86,14.73 38.99,14.73 41.15,16.89 41.15,27.81 32,36.96 30.1,36.96 29.72,37.34 29.72,38.23 30.61,39.12 30.61,48.51 29.59,49.53 28.96,49.53 23.62,44.2 23.62,44.07 23.11,43.56 17.4,43.56
SS  (via drill 0.33, 0.35)
  Top 0.356: U4.14 24.13,26.29 24.13,26.92 24.38,27.18 v24.38,27.43 24.51,27.43 24.77,27.69 25.02,27.69 25.27,27.94 25.4,27.94 26.67,26.67 26.67,26.42 27.69,25.4 28.19,25.4 v28.45,25.15
  Bottom 0.356: JP2.8 36.45,19.94 30.99,19.94 v30.87,19.98 30.73,20.07 30.73,20.7 28.45,22.99 v28.45,25.15
TX-O  (via drill 0.33, 0.35)
  Top 0.356: v21.18,33.53 21.21,33.53 21.21,33.78 20.83,34.16 20.95,34.29 20.95,34.67 U4.31 20.83,34.92 20.83,35.31 20.95,35.43 20.95,35.81 19.18,37.59 19.18,39.24 17.91,40.51 17.91,40.64 | v29.39,34.67 30.48,34.67 R9.1 | v15.19,39.79 15.24,39.75 15.37,39.75 16,39.12 16.26,39.12 16.89,39.75 17.14,39.75 v17.17,39.79 17.02,39.88 17.78,40.64 17.91,40.64 | 17.91,40.64 v18.16,40.89
  Bottom 0.356: JP11.2 5.84,34.8 11.94,34.8 15.11,37.97 15.11,39.75 v15.19,39.79 | v29.39,34.67 28.7,34.67 28.07,35.31 26.67,35.31 24.51,37.47 21.59,37.47 v18.16,40.89
TXD  (via drill 0.33, 0.35)
  Top 0.356: U1.20 30.23,40.39 30.1,40.39 29.97,40.26 30.1,40.13 30.1,39.88 29.84,39.62 29.84,39.5 v29.88,39.46 29.72,39.5 29.46,39.5 28.7,40.26 26.92,40.26 25.15,42.04 25.15,45.34 23.37,47.12 17.02,47.12 v15.37,45.47 | v12.22,39.46 12.32,39.37 12.57,39.37 12.7,39.24 13.08,39.24 13.46,38.86 13.46,38.1 R8.2
  Bottom 0.356: v13.87,49.7 13.84,49.66 12.57,48.39 v12.55,48.37 12.7,48.26 12.7,47.75 15.18,45.28 | 15.18,45.28 15.62,44.83 15.62,42.16 12.95,39.5 12.32,39.5 v12.22,39.46 | 15.18,45.28 v15.37,45.47
TXLED  (via drill 0.35)
  Top 0.356: v35.66,49.37 35.69,49.4 35.69,50.42 35.56,50.55 LED3.C | U1.10 35.69,46.1 35.69,46.86 v35.66,46.89
  Bottom 0.356: v35.66,46.89 35.69,46.99 35.69,49.28 v35.66,49.37
USBVCC  (via drill 0.33, 0.35)
  Top 0.356: U1.15 30.35,43.43 30.99,43.43 31.24,43.69 31.37,43.69 31.5,43.56 31.62,43.56 v31.7,43.59 | v24.43,15.85 24.38,15.88 24.26,15.88 24.13,15.75 23.88,15.75 23.75,15.88 23.24,15.88 22.86,15.49 F1.2 | F1.2 22.73,15.49 22.48,15.75 20.57,15.75 18.67,17.65 v18.49,17.67 18.41,17.65 17.53,17.65 17.4,17.78 C12.1 17.27,17.65 17.27,17.02 16.76,16.51 16.13,16.51 13.97,14.35 5.84,14.35 1.27,18.92 1.27,19.68 v2.03,20.45 | v24.77,17.91 23.37,16.51 23.37,16 F1.2
  Bottom 0.356: v31.7,43.59 31.75,43.69 31.75,45.47 v31.7,45.57 31.75,45.59 33.27,47.12 v33.35,47.22 33.4,47.37 33.4,59.44 34.29,60.33 34.29,61.59 32.38,63.5 6.99,63.5 6.35,62.87 6.35,59.05 5.71,58.42 4.45,58.42 3.81,57.78 3.81,56.52 7.87,52.45 8.64,52.45 9.14,51.94 9.14,49.66 7.49,48.01 7.49,45.72 2.16,40.39 2.16,20.57 v2.03,20.45 | v24.77,17.91 25.53,18.67 C15.+
VUSB
  Top 0.356: 15.94,13.02 16.26,12.7 22.73,12.7 F1.1 | 15.94,13.02 15.75,13.21 15.75,13.97 C10.1 | 15.94,13.02 13.21,10.29 9.91,10.29 8.89,9.27 JP12.VBUS

### Text on the board
tPlace: 3 | V2 | Group 3 | Group 3
bPlace: 3 | V2
tNames: RESET | 5V | Vin | GND | GND | 5V | 3.3V | GND | RESET | SCK | MOSI | 5V | MISO | 5V | MOSI | MISO | RXI | GND | TXO | IO2 | IO3 | IO4 | IO5 | IO6 | SS | IO7 | MOSI | MISO | SCK | GND | AREF | SCL | SDA | VCC | TXO | RXI | DTR | SDA | SCL